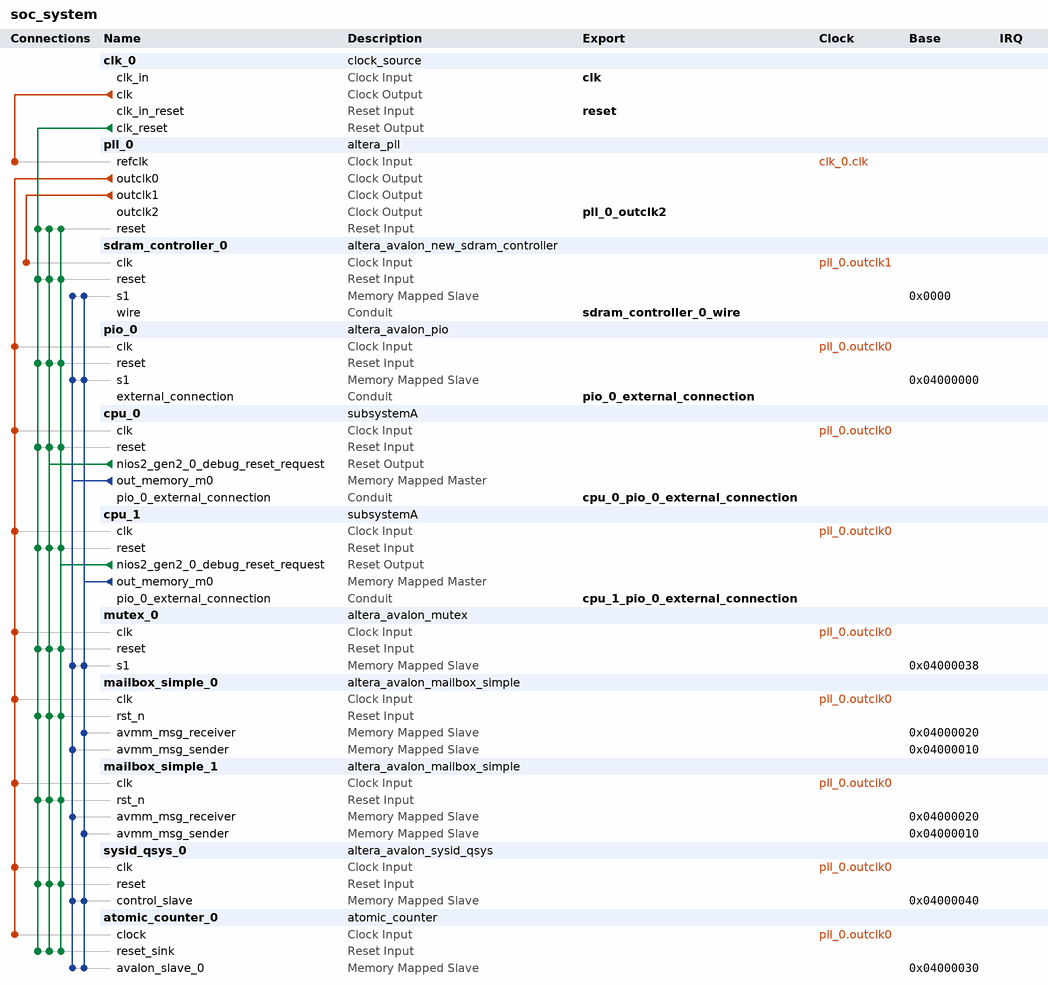
[diagram p0: system contents]
# Platform Designer (Qsys) system soc_system, Cyclone V 5CSEMA5F31C6
# Parameters at their usual value, and those the tool derives, are not listed.
package require -exact qsys 18.1
create_system soc_system
set_project_property DEVICE_FAMILY {Cyclone V}
set_project_property DEVICE 5CSEMA5F31C6

add_instance clk_0 clock_source 18.1
set_instance_parameter_value clk_0 clockFrequency 50000000

add_instance pll_0 altera_pll 18.1
set_instance_parameter_value pll_0 gui_device_speed_grade 1
set_instance_parameter_value pll_0 gui_number_of_clocks 3
set_instance_parameter_value pll_0 gui_operation_mode direct
set_instance_parameter_value pll_0 gui_output_clock_frequency0 50.0
set_instance_parameter_value pll_0 gui_output_clock_frequency1 100.0
set_instance_parameter_value pll_0 gui_output_clock_frequency2 100.0
set_instance_parameter_value pll_0 gui_phase_shift2 -3758
set_instance_parameter_value pll_0 gui_pll_mode {Integer-N PLL}
set_instance_parameter_value pll_0 gui_reference_clock_frequency 50.0
set_instance_parameter_value pll_0 gui_use_locked false

add_instance sdram_controller_0 altera_avalon_new_sdram_controller 18.1
set_instance_parameter_value sdram_controller_0 TAC 5.4
set_instance_parameter_value sdram_controller_0 TRCD 15.0
set_instance_parameter_value sdram_controller_0 TRP 15.0
set_instance_parameter_value sdram_controller_0 casLatency 3
set_instance_parameter_value sdram_controller_0 columnWidth 10
set_instance_parameter_value sdram_controller_0 dataWidth 16
set_instance_parameter_value sdram_controller_0 generateSimulationModel false
set_instance_parameter_value sdram_controller_0 model single_Micron_MT48LC4M32B2_7_chip
set_instance_parameter_value sdram_controller_0 numberOfBanks 4
set_instance_parameter_value sdram_controller_0 numberOfChipSelects 1
set_instance_parameter_value sdram_controller_0 powerUpDelay 100.0
set_instance_parameter_value sdram_controller_0 refreshPeriod 7.8125
set_instance_parameter_value sdram_controller_0 rowWidth 13

add_instance pio_0 altera_avalon_pio 18.1
set_instance_parameter_value pio_0 direction Bidir
set_instance_parameter_value pio_0 width 8

add_instance cpu_0 subsystemA 1.0

add_instance cpu_1 subsystemA 1.0

add_instance mutex_0 altera_avalon_mutex 18.1

add_instance mailbox_simple_0 altera_avalon_mailbox_simple 18.1
set_instance_parameter_value mailbox_simple_0 AWIDTH 2
set_instance_parameter_value mailbox_simple_0 DWIDTH 32
set_instance_parameter_value mailbox_simple_0 MSG_ARRIVAL_NOTIFY 0
set_instance_parameter_value mailbox_simple_0 MSG_SPACE_NOTIFY 0

add_instance mailbox_simple_1 altera_avalon_mailbox_simple 18.1
set_instance_parameter_value mailbox_simple_1 AWIDTH 2
set_instance_parameter_value mailbox_simple_1 DWIDTH 32
set_instance_parameter_value mailbox_simple_1 MSG_ARRIVAL_NOTIFY 0
set_instance_parameter_value mailbox_simple_1 MSG_SPACE_NOTIFY 0

add_instance sysid_qsys_0 altera_avalon_sysid_qsys 18.1
set_instance_parameter_value sysid_qsys_0 id 0

add_instance atomic_counter_0 atomic_counter 1.0

# connections
add_connection clk_0.clk pll_0.refclk clock
add_connection pll_0.outclk0 atomic_counter_0.clock clock
add_connection pll_0.outclk0 cpu_0.clk clock
add_connection pll_0.outclk0 cpu_1.clk clock
add_connection pll_0.outclk0 mailbox_simple_0.clk clock
add_connection pll_0.outclk0 mailbox_simple_1.clk clock
add_connection pll_0.outclk0 mutex_0.clk clock
add_connection pll_0.outclk0 pio_0.clk clock
add_connection pll_0.outclk0 sysid_qsys_0.clk clock
add_connection pll_0.outclk1 sdram_controller_0.clk clock
add_connection clk_0.clk_reset atomic_counter_0.reset_sink reset
add_connection clk_0.clk_reset cpu_0.reset reset
add_connection clk_0.clk_reset cpu_1.reset reset
add_connection clk_0.clk_reset mailbox_simple_0.rst_n reset
add_connection clk_0.clk_reset mailbox_simple_1.rst_n reset
add_connection clk_0.clk_reset mutex_0.reset reset
add_connection clk_0.clk_reset pio_0.reset reset
add_connection clk_0.clk_reset pll_0.reset reset
add_connection clk_0.clk_reset sdram_controller_0.reset reset
add_connection clk_0.clk_reset sysid_qsys_0.reset reset
add_connection cpu_0.nios2_gen2_0_debug_reset_request atomic_counter_0.reset_sink reset
add_connection cpu_0.nios2_gen2_0_debug_reset_request cpu_0.reset reset
add_connection cpu_0.nios2_gen2_0_debug_reset_request cpu_1.reset reset
add_connection cpu_0.nios2_gen2_0_debug_reset_request mailbox_simple_0.rst_n reset
add_connection cpu_0.nios2_gen2_0_debug_reset_request mailbox_simple_1.rst_n reset
add_connection cpu_0.nios2_gen2_0_debug_reset_request mutex_0.reset reset
add_connection cpu_0.nios2_gen2_0_debug_reset_request pio_0.reset reset
add_connection cpu_0.nios2_gen2_0_debug_reset_request pll_0.reset reset
add_connection cpu_0.nios2_gen2_0_debug_reset_request sdram_controller_0.reset reset
add_connection cpu_0.nios2_gen2_0_debug_reset_request sysid_qsys_0.reset reset
add_connection cpu_1.nios2_gen2_0_debug_reset_request atomic_counter_0.reset_sink reset
add_connection cpu_1.nios2_gen2_0_debug_reset_request cpu_0.reset reset
add_connection cpu_1.nios2_gen2_0_debug_reset_request cpu_1.reset reset
add_connection cpu_1.nios2_gen2_0_debug_reset_request mailbox_simple_0.rst_n reset
add_connection cpu_1.nios2_gen2_0_debug_reset_request mailbox_simple_1.rst_n reset
add_connection cpu_1.nios2_gen2_0_debug_reset_request mutex_0.reset reset
add_connection cpu_1.nios2_gen2_0_debug_reset_request pio_0.reset reset
add_connection cpu_1.nios2_gen2_0_debug_reset_request pll_0.reset reset
add_connection cpu_1.nios2_gen2_0_debug_reset_request sdram_controller_0.reset reset
add_connection cpu_1.nios2_gen2_0_debug_reset_request sysid_qsys_0.reset reset
add_connection cpu_0.out_memory_m0 atomic_counter_0.avalon_slave_0 avalon
set_connection_parameter_value cpu_0.out_memory_m0/atomic_counter_0.avalon_slave_0 baseAddress 0x04000030
add_connection cpu_0.out_memory_m0 mailbox_simple_0.avmm_msg_sender avalon
set_connection_parameter_value cpu_0.out_memory_m0/mailbox_simple_0.avmm_msg_sender baseAddress 0x04000010
add_connection cpu_0.out_memory_m0 mailbox_simple_1.avmm_msg_receiver avalon
set_connection_parameter_value cpu_0.out_memory_m0/mailbox_simple_1.avmm_msg_receiver baseAddress 0x04000020
add_connection cpu_0.out_memory_m0 mutex_0.s1 avalon
set_connection_parameter_value cpu_0.out_memory_m0/mutex_0.s1 baseAddress 0x04000038
add_connection cpu_0.out_memory_m0 pio_0.s1 avalon
set_connection_parameter_value cpu_0.out_memory_m0/pio_0.s1 baseAddress 0x04000000
add_connection cpu_0.out_memory_m0 sdram_controller_0.s1 avalon
set_connection_parameter_value cpu_0.out_memory_m0/sdram_controller_0.s1 baseAddress 0x0000
add_connection cpu_0.out_memory_m0 sysid_qsys_0.control_slave avalon
set_connection_parameter_value cpu_0.out_memory_m0/sysid_qsys_0.control_slave baseAddress 0x04000040
add_connection cpu_1.out_memory_m0 atomic_counter_0.avalon_slave_0 avalon
set_connection_parameter_value cpu_1.out_memory_m0/atomic_counter_0.avalon_slave_0 baseAddress 0x04000030
add_connection cpu_1.out_memory_m0 mailbox_simple_0.avmm_msg_receiver avalon
set_connection_parameter_value cpu_1.out_memory_m0/mailbox_simple_0.avmm_msg_receiver baseAddress 0x04000020
add_connection cpu_1.out_memory_m0 mailbox_simple_1.avmm_msg_sender avalon
set_connection_parameter_value cpu_1.out_memory_m0/mailbox_simple_1.avmm_msg_sender baseAddress 0x04000010
add_connection cpu_1.out_memory_m0 mutex_0.s1 avalon
set_connection_parameter_value cpu_1.out_memory_m0/mutex_0.s1 baseAddress 0x04000038
add_connection cpu_1.out_memory_m0 pio_0.s1 avalon
set_connection_parameter_value cpu_1.out_memory_m0/pio_0.s1 baseAddress 0x04000000
add_connection cpu_1.out_memory_m0 sdram_controller_0.s1 avalon
set_connection_parameter_value cpu_1.out_memory_m0/sdram_controller_0.s1 baseAddress 0x0000
add_connection cpu_1.out_memory_m0 sysid_qsys_0.control_slave avalon
set_connection_parameter_value cpu_1.out_memory_m0/sysid_qsys_0.control_slave baseAddress 0x04000040

# exported interfaces
add_interface clk clock sink
set_interface_property clk EXPORT_OF clk_0.clk_in
add_interface cpu_0_pio_0_external_connection conduit end
set_interface_property cpu_0_pio_0_external_connection EXPORT_OF cpu_0.pio_0_external_connection
add_interface cpu_1_pio_0_external_connection conduit end
set_interface_property cpu_1_pio_0_external_connection EXPORT_OF cpu_1.pio_0_external_connection
add_interface pio_0_external_connection conduit end
set_interface_property pio_0_external_connection EXPORT_OF pio_0.external_connection
add_interface pll_0_outclk2 clock source
set_interface_property pll_0_outclk2 EXPORT_OF pll_0.outclk2
add_interface reset reset sink
set_interface_property reset EXPORT_OF clk_0.clk_in_reset
add_interface sdram_controller_0_wire conduit end
set_interface_property sdram_controller_0_wire EXPORT_OF sdram_controller_0.wire

set_interconnect_requirement {$system} qsys_mm.clockCrossingAdapter HANDSHAKE
set_interconnect_requirement {$system} qsys_mm.enableEccProtection FALSE
set_interconnect_requirement {$system} qsys_mm.insertDefaultSlave FALSE
set_interconnect_requirement {$system} qsys_mm.maxAdditionalLatency 1

save_system soc_system.qsys
